# Altium schematic sheet Power.SchDoc: Power
size A4; Date: 9/24/2014; Author: P.A.; CompanyName: STMicroelectronics; Organization: Microcontrollers Division; Address1: 12, Rue Jules HOROWITZ; Address2: 38019 Grenoble; Address3: FRANCE; DocumentNumber: MB1189; Revision: B-07; SheetNumber: 4; SheetTotal: 12; Project: STM32F469I-DISCO
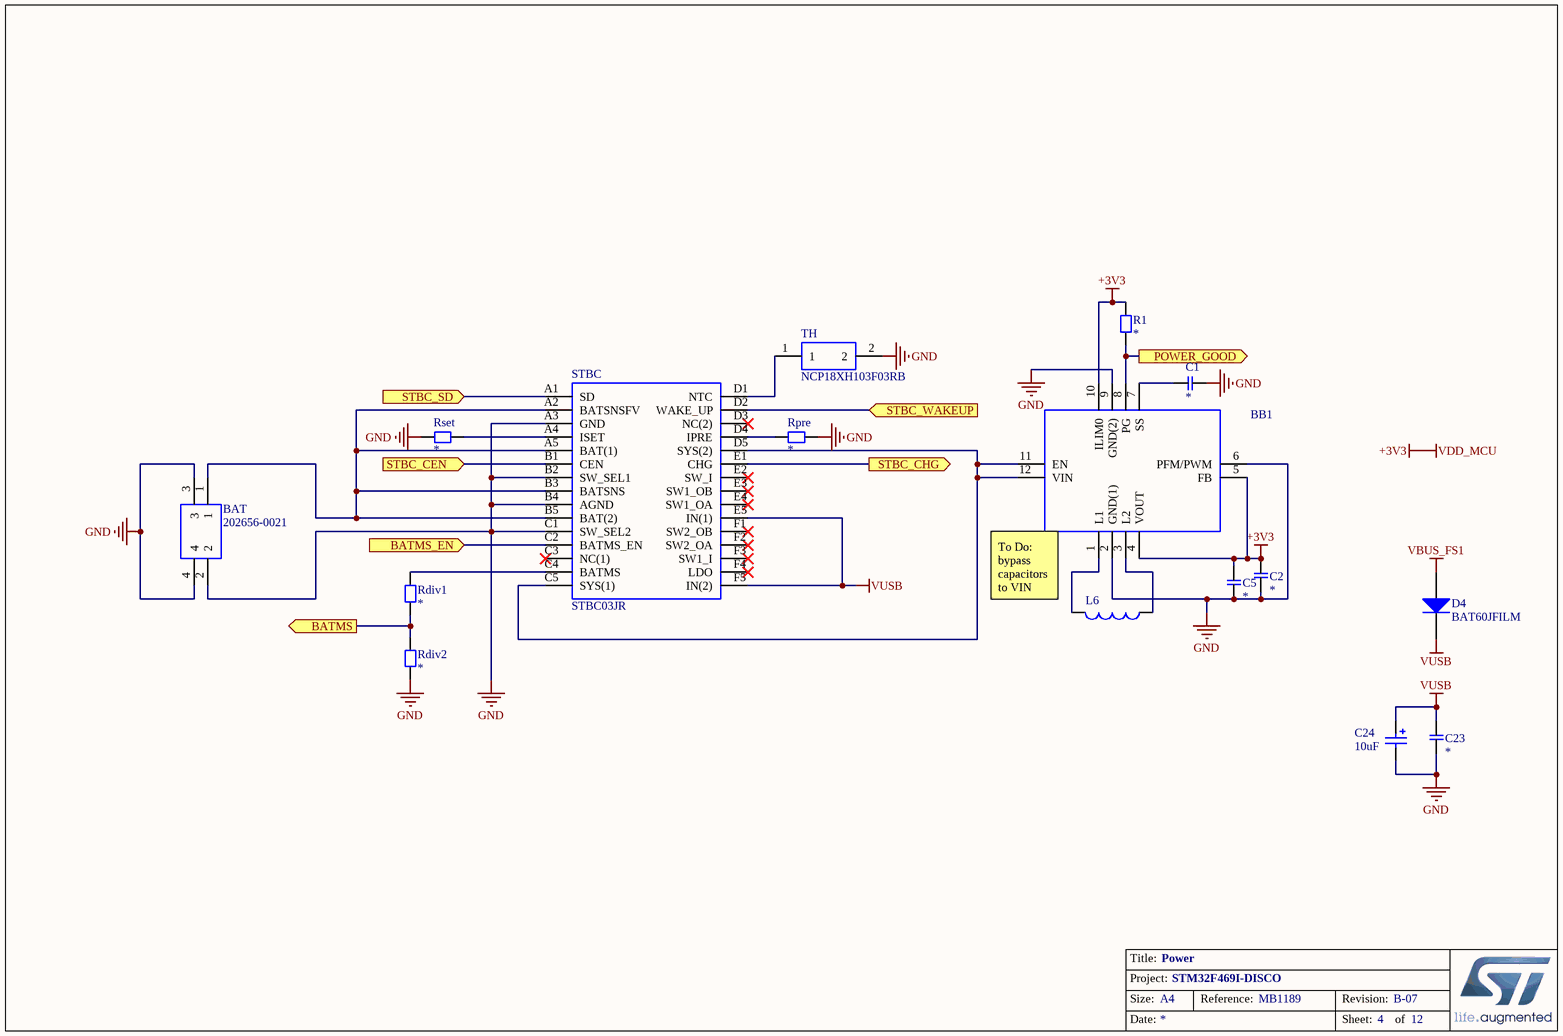
[diagram p0: Power.SchDoc]

## Parts
BAT  202656-0021  [2026560021]
BB1  TPS63051RMWT  [QFN50P250X250X100-12N-D]  (value not drawn)
C1  1nF  [CAP - 0402]  (value not drawn)
C2  10uF  [CAP - 0402]  (value not drawn)
C5  100nF  [CAP - 0402]  (value not drawn)
C23  10uF  [CAP - 0402]  (value not drawn)
C24  10uF  [A]
D4  BAT60JFILM  [SOD323]
L6  1269AS-H-1R5M=P2  [INDC2928X203N]  (value not drawn)
R1  1M  [RES - 1206]  (value not drawn)
Rdiv1  100k  [RES - 0402]  (value not drawn)
Rdiv2  200K  [RES - 0402]  (value not drawn)
Rpre  1K  [RES - 0402]  (value not drawn)
Rset  430 Ohm  [RES - 0402]  (value not drawn)
STBC  STBC03JR  [BGA30C40P5X6_225X259X60]
TH  NCP18XH103F03RB  [THRMC1608X95N]

## Ports
BATMS (out), BATMS_EN (in), POWER_GOOD (out), STBC_CEN (in), STBC_CHG (out), STBC_SD (in), STBC_WAKEUP (in)

## Nets
+3V3: BB1.4(VOUT) BB1.5(FB) BB1.10(ILIM0) C2.1 C5.1 R1.1  [also labelled VDD_MCU]
GND: BAT.2 BAT.3 BAT.4 BB1.2(GND(1)) BB1.6(PFM/PWM) BB1.9(GND(2)) C1.2 C2.2 C5.2 C23.2 C24.2 Rdiv2.1 Rpre.1 Rset.2 STBC.A3(GND) STBC.B2(SW_SEL1) STBC.B4(AGND) STBC.C1(SW_SEL2) TH.2
VBUS_FS1: D4.1(A)
VUSB: C23.1 C24.1 D4.2(K) STBC.E5(IN(1)) STBC.F5(IN(2))
BATMS: Rdiv1.1 Rdiv2.2 ; port BATMS
BATMS_EN: STBC.C2(BATMS_EN) ; port BATMS_EN
POWER_GOOD: BB1.8(PG) R1.2 ; port POWER_GOOD
STBC_CEN: STBC.B1(CEN) ; port STBC_CEN
STBC_CHG: STBC.E1(CHG) ; port STBC_CHG
STBC_SD: STBC.A1(SD) ; port STBC_SD
STBC_WAKEUP: STBC.D2(WAKE_UP) ; port STBC_WAKEUP
NetBAT_1: BAT.1 STBC.A2(BATSNSFV) STBC.A5(BAT(1)) STBC.B3(BATSNS) STBC.B5(BAT(2))
NetBB1_1: BB1.1(L1) L6.2
NetBB1_3: BB1.3(L2) L6.1
NetBB1_7: BB1.7(SS) C1.1
NetBB1_11: BB1.11(EN) BB1.12(VIN) STBC.C5(SYS(1)) STBC.D5(SYS(2))
NetRdiv1_2: Rdiv1.2 STBC.C4(BATMS)
NetRpre_2: Rpre.2 STBC.D4(IPRE)
NetRset_1: Rset.1 STBC.A4(ISET)
NetSTBC_D1: STBC.D1(NTC) TH.1

Not connected (* = marked no-connect by the designer): STBC C3(NC(1))* D3(NC(2))* E2(SW_I)* E3(SW1_OB)* E4(SW1_OA)* F1(SW2_OB)* F2(SW2_OA)* F3(SW1_I)* F4(LDO)*

## Notes on the sheet
- (near BB1) To Do: bypass capacitors to VIN
- Title:
- Project:
- Size:
- Date:
- A4
- Reference:
- Sheet:
- Revision:
- of

## Library data of the parts
BAT = 202656-0021: MOLEX - 202656-0021 - PLUG HOUSING, 2POS, NYLON, BLACK; Geometry.Height: 1mm; Manufacturer_Name: Molex; Manufacturer_Part_Number: 202656-0021; RS Part Number: *; RS Price/Stock: *; Mouser Part Number: 538-202656-0021; Mouser Price/Stock: https://www.mouser.com/Search/Refine.aspx?Keyword=538-202656-0021; Datasheet Link: https://www.molex.com/webdocs/datasheets/pdf/en-us/2026560021_PCB_HEADERS.pdf
BB1 = TPS63051RMWT: Switching Voltage Regulators Tiny Single Ind Buck Boost Convter; Manufacturer_Name: Texas Instruments; Geometry.Height: 1mm; Manufacturer_Part_Number: TPS63051RMWT; RS Part Number: *; RS Price/Stock: *; Datasheet Link: http://www.ti.com/general/docs/lit/getliterature.tsp?genericPartNumber=TPS63051&&fileType=pdf
C1 C2 C5 C23 = capacitor: Parameter 1: *; Parameter 2: *; Value: *
C24 = Cap Pol1: Polarized Capacitor (Radial); Ordered by: Subcon; Published: 8-Jun-2000; Revision: July-2002: Re-released for DXP Platform.; Publisher: Altium Limited; Value: 10uF
D4 = BAT60JFILM: Provided: ST; ECCN_US/EU: EAR99/NEC; Ref St: 9151097; Revision: July-2002: Re-released for DXP Platform.; Order: BAT60JFILM; Manuf_Part_1: BAT60JFILM; Manuf_1: ST; Distrib: ST; Ordered by: ST
L6 = Inductor: Code_IEC: 1005; Value: 10mH; Published: 8-Jun-2000; LatestRevisionDate: 29-May-2009; LatestRevisionNote: IPC-7351 Footprint Added.; PackageReference: 0402-A; Publisher: Altium Limited; PackageDescription: Chip Inductor; Code_JEITA: 0402
R1 Rdiv1 Rdiv2 Rpre Rset = resistor: Parameter 1: *; Parameter 2: *; Value: *
STBC = STBC03JR: STMICROELECTRONICS - STBC03JR - BATTERY CHARGER, LI-ION/POL, FLIPCHIP-30; Geometry.Height: 0.6mm; Manufacturer_Name: STMicroelectronics; Manufacturer_Part_Number: STBC03JR; RS Part Number: *; RS Price/Stock: *; Datasheet Link: http://www.st.com/content/ccc/resource/technical/document/datasheet/group3/05/ea/e8/4e/a7/a6/4a/c6/DM00338132/files/DM00338132.pdf/jcr:content/translations/en.DM00338132.pdf
TH = NCP18XH103F03RB: Thermistor NTC 10K Ohm 1% 2-Pin 0603 Surface Mount Solder Pad 3434K T/R; Manufacturer_Name: Murata Electronics; Geometry.Height: 0.95mm; Manufacturer_Part_Number: NCP18XH103F03RB; RS Part Number: 7259057P; RS Price/Stock: http://uk.rs-online.com/web/p/products/7259057P; Mouser Part Number: 81-NCP18XH103F03RB; Mouser Price/Stock: https://www.mouser.com/Search/Refine.aspx?Keyword=81-NCP18XH103F03RB; Datasheet Link: https://componentsearchengine.com/Datasheets/2/NCP18XH103F03RB.pdf